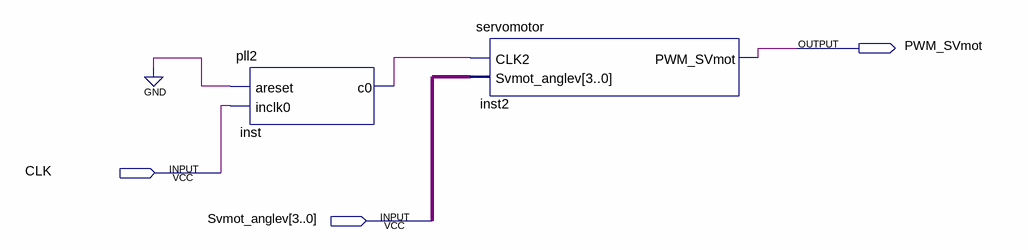
[diagram p0: schematic sheet]
// Quartus schematic Block1.bdf as structural Verilog: 2 symbols, 3 pins
module Block1 (
  input  CLK,
  input  [3:0] Svmot_anglev,
  output PWM_SVmot
);

  wire inst_c0;

  pll2 inst (.areset(1'b0), .inclk0(CLK), .c0(inst_c0));
  servomotor inst2 (.CLK2(inst_c0), .Svmot_anglev(Svmot_anglev), .PWM_SVmot(PWM_SVmot));
endmodule
